# Altium schematic sheet fpga-expansion.SchDoc
size Legal; CompanyName: Brinton Engineering, LLC; Address1: 3479 Edison Way; Address2: Menlo Park CA 94025; Address3: +1 (877) 778-8435; Address4: brintonengineering.com; DocumentNumber: 39; Revision: 1; SheetNumber: 39; SheetTotal: 50
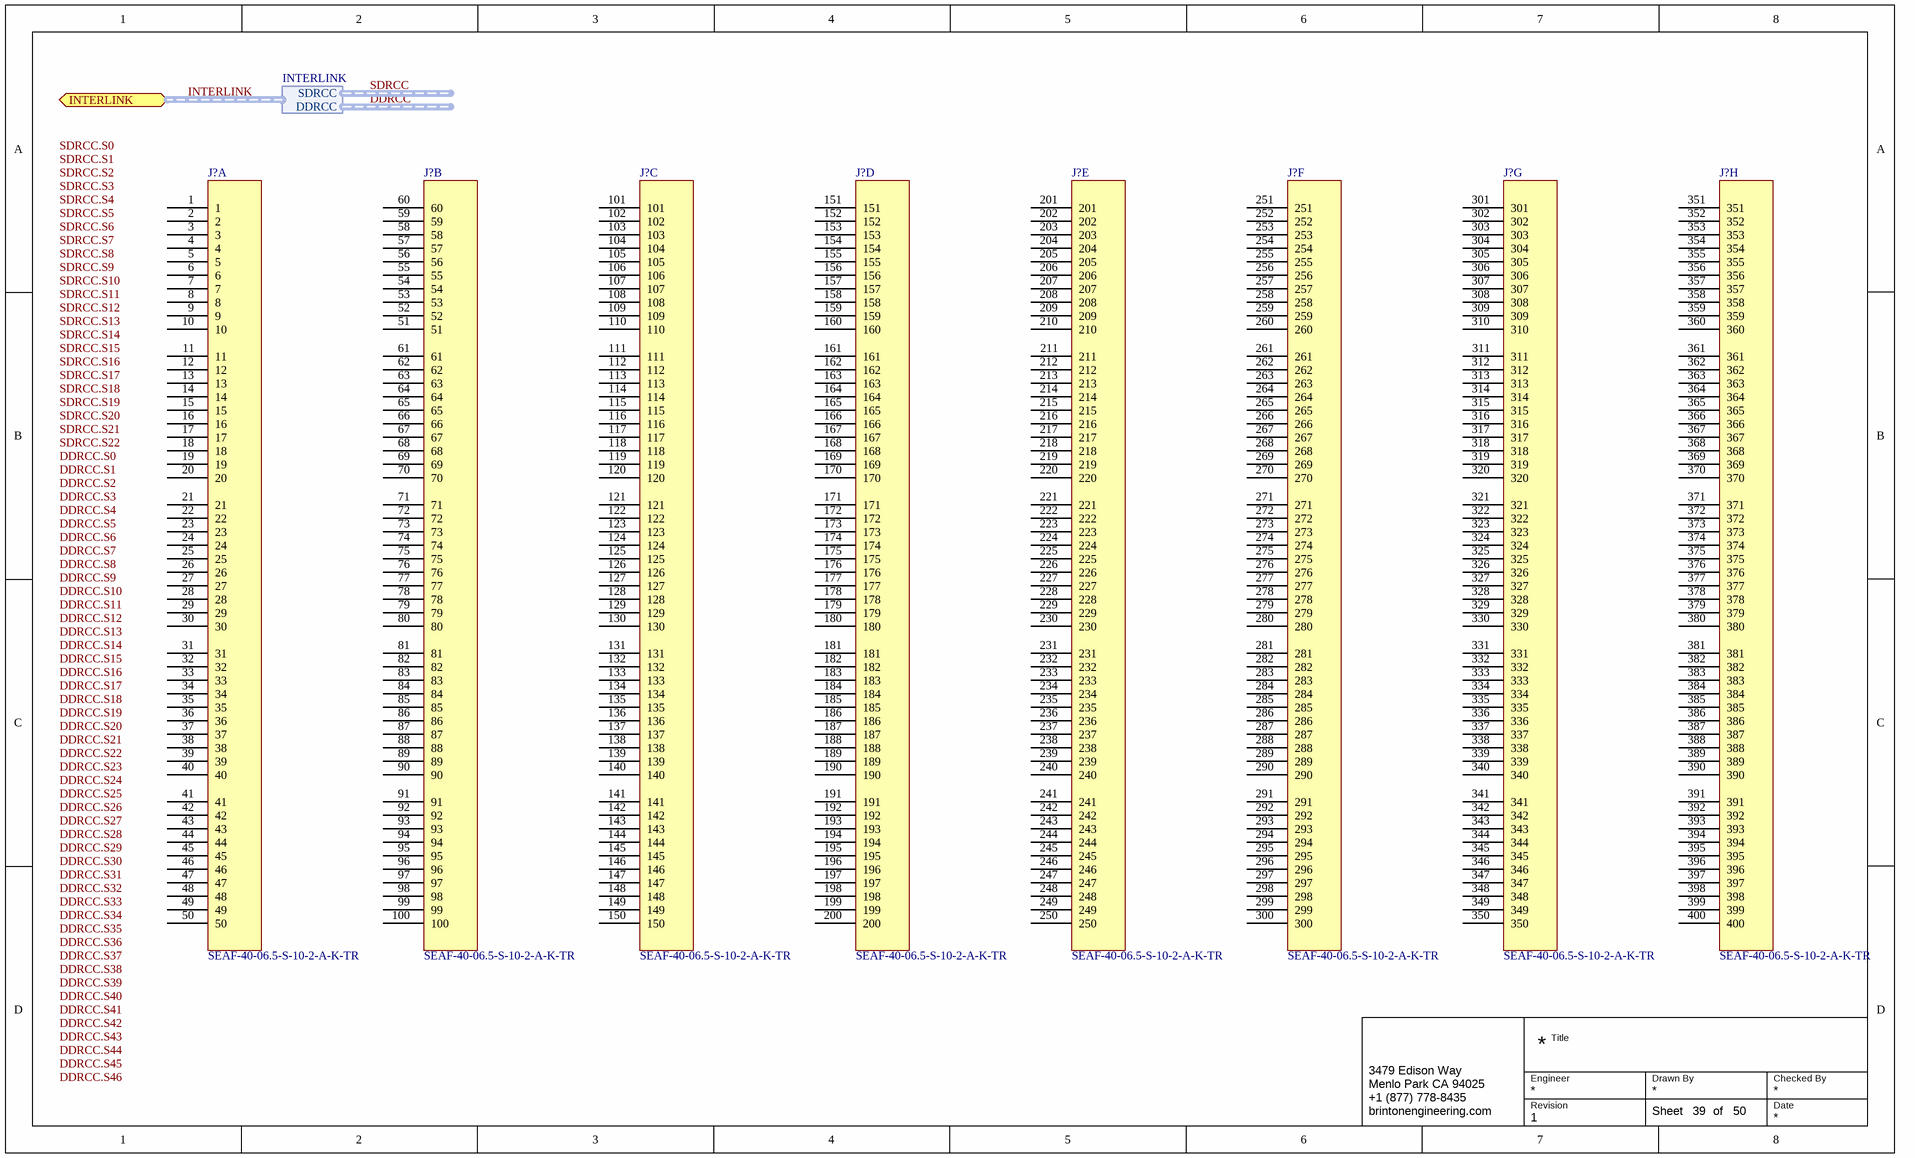
[diagram p0: fpga-expansion.SchDoc]

## Parts
(Parts that share a designator on the sheet are numbered #1, #2 ... from top to bottom, then left to right.)
J?#1  SEAF-40-06.5-S-10-2-A-K-TR  [SEAF-40-06.5-S-10-2-A-K-TR]  (part A of 8)
J?#2  SEAF-40-06.5-S-10-2-A-K-TR  [SEAF-40-06.5-S-10-2-A-K-TR]  (part B of 8)
J?#3  SEAF-40-06.5-S-10-2-A-K-TR  [SEAF-40-06.5-S-10-2-A-K-TR]  (part C of 8)
J?#4  SEAF-40-06.5-S-10-2-A-K-TR  [SEAF-40-06.5-S-10-2-A-K-TR]  (part D of 8)
J?#5  SEAF-40-06.5-S-10-2-A-K-TR  [SEAF-40-06.5-S-10-2-A-K-TR]  (part E of 8)
J?#6  SEAF-40-06.5-S-10-2-A-K-TR  [SEAF-40-06.5-S-10-2-A-K-TR]  (part F of 8)
J?#7  SEAF-40-06.5-S-10-2-A-K-TR  [SEAF-40-06.5-S-10-2-A-K-TR]  (part G of 8)
J?#8  SEAF-40-06.5-S-10-2-A-K-TR  [SEAF-40-06.5-S-10-2-A-K-TR]  (part H of 8)

## Ports
INTERLINK (harness INTERLINK)

## Harnesses
INTERLINK: DDRCC, SDRCC

## Nets

Not connected (* = marked no-connect by the designer): J?#1 1 2 3 4 5 6 7 8 9 10 11 12 13 14 15 16 17 18 19 20 21 22 23 24 25 26 27 28 29 30 31 32 33 34 35 36 37 38 39 40 41 42 43 44 45 46 47 48 49 50; J?#2 51 52 53 54 55 56 57 58 59 60 61 62 63 64 65 66 67 68 69 70 71 72 73 74 75 76 77 78 79 80 81 82 83 84 85 86 87 88 89 90 91 92 93 94 95 96 97 98 99 100; J?#3 101 102 103 104 105 106 107 108 109 110 111 112 113 114 115 116 117 118 119 120 121 122 123 124 125 126 127 128 129 130 131 132 133 134 135 136 137 138 139 140 141 142 143 144 145 146 147 148 149 150; J?#4 151 152 153 154 155 156 157 158 159 160 161 162 163 164 165 166 167 168 169 170 171 172 173 174 175 176 177 178 179 180 181 182 183 184 185 186 187 188 189 190 191 192 193 194 195 196 197 198 199 200; J?#5 201 202 203 204 205 206 207 208 209 210 211 212 213 214 215 216 217 218 219 220 221 222 223 224 225 226 227 228 229 230 231 232 233 234 235 236 237 238 239 240 241 242 243 244 245 246 247 248 249 250; J?#6 251 252 253 254 255 256 257 258 259 260 261 262 263 264 265 266 267 268 269 270 271 272 273 274 275 276 277 278 279 280 281 282 283 284 285 286 287 288 289 290 291 292 293 294 295 296 297 298 299 300; J?#7 301 302 303 304 305 306 307 308 309 310 311 312 313 314 315 316 317 318 319 320 321 322 323 324 325 326 327 328 329 330 331 332 333 334 335 336 337 338 339 340 341 342 343 344 345 346 347 348 349 350; J?#8 351 352 353 354 355 356 357 358 359 360 361 362 363 364 365 366 367 368 369 370 371 372 373 374 375 376 377 378 379 380 381 382 383 384 385 386 387 388 389 390 391 392 393 394 395 396 397 398 399 400

## Buses and harness runs
harness INTERLINK = port INTERLINK

## Notes on the sheet
- Title
- Engineer
- Revision
- Drawn By
- Checked By
- Date
- Sheet
- of
- Labels drawn without touching a wire or pin: DDRCC.S0, DDRCC.S1, DDRCC.S2, DDRCC.S3, DDRCC.S4, DDRCC.S5, DDRCC.S6, DDRCC.S7, DDRCC.S8, DDRCC.S9, DDRCC.S10, DDRCC.S11, DDRCC.S12, DDRCC.S13, DDRCC.S14, DDRCC.S15, DDRCC.S16, DDRCC.S17, DDRCC.S18, DDRCC.S19, DDRCC.S20, DDRCC.S21, DDRCC.S22, DDRCC.S23, DDRCC.S24, DDRCC.S25, DDRCC.S26, DDRCC.S27, DDRCC.S28, DDRCC.S29, DDRCC.S30, DDRCC.S31, DDRCC.S32, DDRCC.S33, DDRCC.S34, DDRCC.S35, DDRCC.S36, DDRCC.S37, DDRCC.S38, DDRCC.S39, DDRCC.S40, DDRCC.S41, DDRCC.S42, DDRCC.S43, DDRCC.S44, DDRCC.S45, DDRCC.S46, SDRCC.S0, SDRCC.S1, SDRCC.S2, SDRCC.S3, SDRCC.S4, SDRCC.S5, SDRCC.S6, SDRCC.S7, SDRCC.S8, SDRCC.S9, SDRCC.S10, SDRCC.S11, SDRCC.S12, SDRCC.S13, SDRCC.S14, SDRCC.S15, SDRCC.S16, SDRCC.S17, SDRCC.S18, SDRCC.S19, SDRCC.S20, SDRCC.S21, SDRCC.S22

## Library data of the parts
J?#1-J?#8 = SEAF-40-06.5-S-10-2-A-K-TR: Terminal Array Assembly, Surface Mount, 0.050" Pitch, 400 Pins; Manufacturer: Samtec; Manufacturer P/N: SEAF-40-06.5-S-10-2-A-K-TR